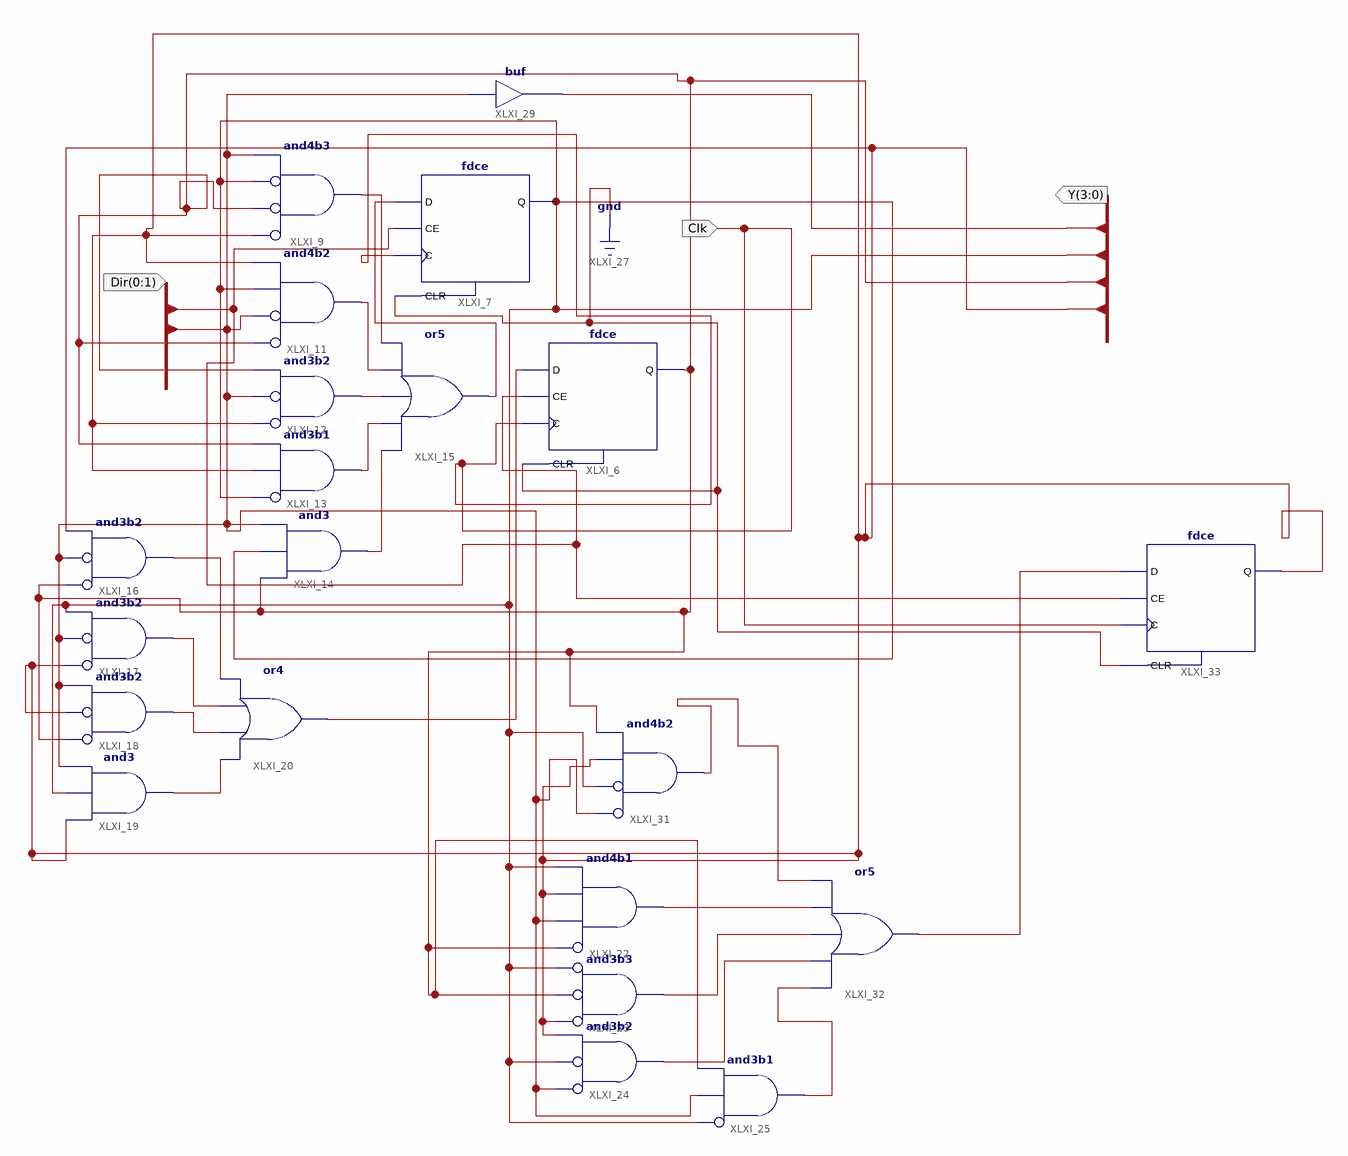
[diagram p0: schematic sheet 1]
// Xilinx ISE schematic schemat.sch (xc9500xl) as structural Verilog: 21 symbols, 3 ports
module schemat (
  input  [0:1] Dir,
  input  Clk,
  output [3:0] Y
);

  wire XLXN_22, XLXN_23, XLXN_24, XLXN_25, XLXN_27, XLXN_28, XLXN_38, XLXN_39, XLXN_40, XLXN_41, XLXN_42,
       XLXN_60, XLXN_61, XLXN_62, XLXN_63, XLXN_86, XLXN_89;

  fdce XLXI_6 (.C(Clk), .CE(Dir[1]), .CLR(1'b0), .D(XLXN_42), .Q(Y[1]));
  fdce XLXI_7 (.C(Clk), .CE(Dir[1]), .CLR(1'b0), .D(XLXN_28), .Q(Y[2]));
  and XLXI_11 (XLXN_23, ~Y[1], ~Dir[0], Y[2], Y[0]);  // and4b2
  and XLXI_12 (XLXN_24, ~Y[0], ~Dir[0], Y[1]);  // and3b2
  and XLXI_13 (XLXN_25, ~Y[2], Y[0], Y[1]);  // and3b1
  and XLXI_14 (XLXN_27, Y[1], Y[2], Dir[0]);
  or XLXI_15 (XLXN_28, XLXN_27, XLXN_25, XLXN_24, XLXN_23, XLXN_22);
  and XLXI_16 (XLXN_38, ~Y[1], ~Dir[0], Y[0]);  // and3b2
  and XLXI_17 (XLXN_39, ~Y[0], ~Dir[0], Y[2]);  // and3b2
  and XLXI_18 (XLXN_40, ~Y[1], ~Y[0], Dir[0]);  // and3b2
  and XLXI_19 (XLXN_41, Y[0], Y[2], Dir[0]);
  or XLXI_20 (XLXN_42, XLXN_41, XLXN_40, XLXN_39, XLXN_38);
  and XLXI_22 (XLXN_60, ~Y[1], Dir[0], Y[0], Y[2]);  // and4b1
  and XLXI_23 (XLXN_61, ~Y[0], ~Y[1], ~Y[2]);  // and3b3
  and XLXI_24 (XLXN_62, ~Dir[0], ~Y[2], Y[0]);  // and3b2
  and XLXI_25 (XLXN_63, ~Y[2], Dir[0], Y[1]);  // and3b1
  buf XLXI_29 (Y[3], Dir[0]);
  and XLXI_9 (XLXN_22, ~Y[0], ~Y[1], ~Y[2], Dir[0]);  // and4b3
  and XLXI_31 (XLXN_86, ~Dir[0], ~Y[2], Y[0], Y[1]);  // and4b2
  or XLXI_32 (XLXN_89, XLXN_63, XLXN_62, XLXN_61, XLXN_60, XLXN_86);
  fdce XLXI_33 (.C(Clk), .CE(Dir[1]), .CLR(1'b0), .D(XLXN_89), .Q(Y[0]));
endmodule
